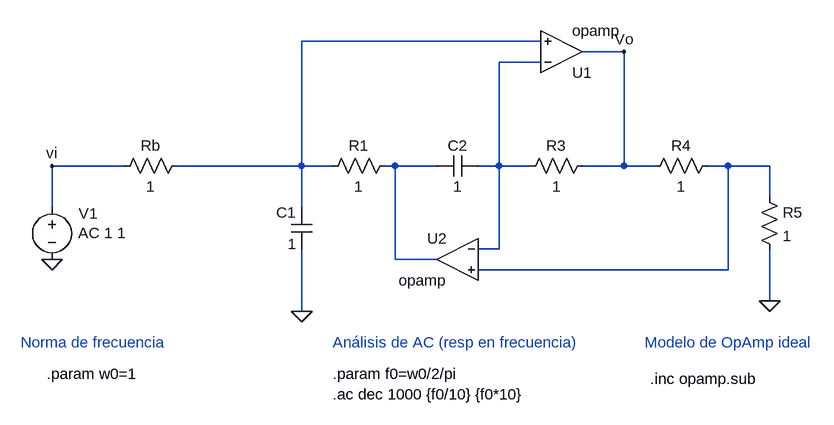
[diagram p0: schematic GIC bandpass norm.asc]
GIC bandpass norm.asc, the LTspice schematic file:
Version 4
SHEET 1 1064 720
WIRE 480 -16 112 -16
WIRE 608 0 544 0
WIRE 480 16 416 16
WIRE -160 176 -272 176
WIRE 112 176 112 -16
WIRE 112 176 -80 176
WIRE 160 176 112 176
WIRE 256 176 240 176
WIRE 320 176 256 176
WIRE 416 176 416 16
WIRE 416 176 384 176
WIRE 464 176 416 176
WIRE 608 176 608 0
WIRE 608 176 544 176
WIRE 656 176 608 176
WIRE 768 176 736 176
WIRE 832 176 768 176
WIRE 832 224 832 176
WIRE -272 240 -272 176
WIRE 112 240 112 176
WIRE 416 304 416 176
WIRE 416 304 384 304
WIRE 256 320 256 176
WIRE 320 320 256 320
WIRE 768 336 768 176
WIRE 768 336 384 336
WIRE 832 384 832 304
WIRE 112 400 112 304
FLAG 832 384 0
FLAG 112 400 0
FLAG -272 320 0
FLAG 608 0 Vo
FLAG -272 176 vi
SYMBOL res -64 160 R90
WINDOW 0 0 56 VBottom 2
WINDOW 3 32 56 VTop 2
SYMATTR InstName Rb
SYMATTR Value 1
SYMBOL res 144 192 R270
WINDOW 0 32 56 VTop 2
WINDOW 3 0 56 VBottom 2
SYMATTR InstName R1
SYMATTR Value 1
SYMBOL res 448 192 R270
WINDOW 0 32 56 VTop 2
WINDOW 3 0 56 VBottom 2
SYMATTR InstName R3
SYMATTR Value 1
SYMBOL res 640 192 R270
WINDOW 0 32 56 VTop 2
WINDOW 3 0 56 VBottom 2
SYMATTR InstName R4
SYMATTR Value 1
SYMBOL res 816 208 R0
SYMATTR InstName R5
SYMATTR Value 1
SYMBOL cap 128 304 R180
WINDOW 0 24 56 Left 2
WINDOW 3 24 8 Left 2
SYMATTR InstName C1
SYMATTR Value 1
SYMBOL cap 320 192 R270
WINDOW 0 32 32 VTop 2
WINDOW 3 0 32 VBottom 2
SYMATTR InstName C2
SYMATTR Value 1
SYMBOL OpAmps\\opamp 512 64 M180
SYMATTR InstName U1
SYMBOL OpAmps\\opamp 352 256 M0
SYMATTR InstName U2
SYMBOL voltage -272 224 R0
WINDOW 123 40 55 Left 2
WINDOW 39 0 0 Left 0
WINDOW 0 41 25 Left 2
SYMATTR Value2 AC 1 1
SYMATTR InstName V1
SYMATTR Value ""
TEXT 648 504 Left 2 !.inc opamp.sub
TEXT 160 528 Left 2 !.ac dec 1000 {f0/10} {f0*10}
TEXT 160 496 Left 2 !.param f0=w0/2/pi
TEXT -280 496 Left 2 !.param w0=1
TEXT -320 448 Left 2 ;Norma de frecuencia
TEXT 160 448 Left 2 ;Análisis de AC (resp en frecuencia)
TEXT 640 448 Left 2 ;Modelo de OpAmp ideal

The netlist it stands for:
* GIC bandpass norm.asc
Rb N001 vi 1
R1 N001 N003 1
R3 N002 Vo 1
R4 Vo N004 1
R5 N004 0 1
C1 0 N001 1
C2 N003 N002 1
XU1 N002 N001 Vo opamp Aol=100K GBW=10Meg  ; pins invin noninvin out
XU2 N002 N004 N003 opamp Aol=100K GBW=10Meg  ; pins invin noninvin out
V1 vi 0 AC 1 1
.inc opamp.sub
.ac dec 1000 {f0/10} {f0*10}
.param f0=w0/2/pi
.param w0=1
* Norma de frecuencia
* Análisis de AC (resp en frecuencia)
* Modelo de OpAmp ideal
.backanno
.end